# Altium schematic sheet S7CAS-PLEIADES-CARTE-MERE_P20_PLL-decouplage.SchDoc
size Tabloid; Sheet_Name: Insert name in Document Parameters; Size: 11x17
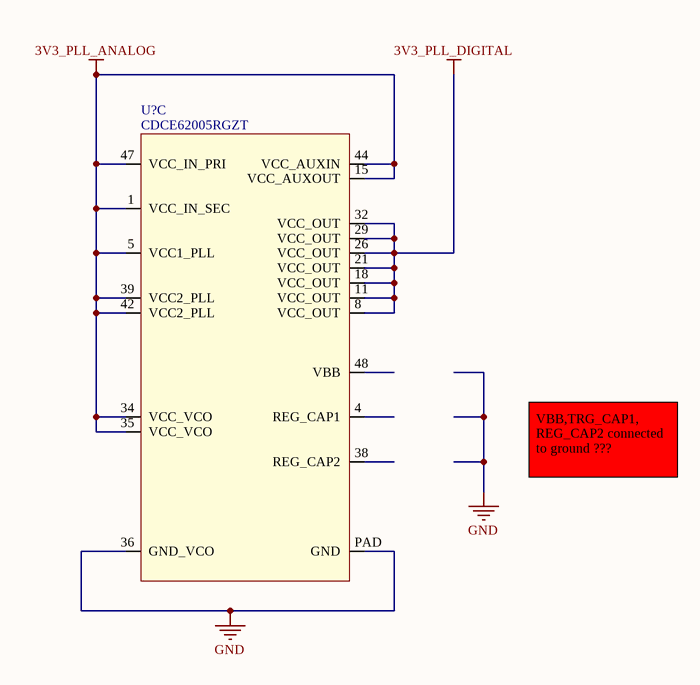
[diagram p0: S7CAS-PLEIADES-CARTE-MERE_P20_PLL-decouplage.SchDoc]

## Parts
U?  CDCE62005RGZT  [TIM_CDCE62005RGZT]  (part C of 3)

## Nets
3V3_PLL_ANALOG: U?.1(VCC_IN_SEC) U?.5(VCC1_PLL) U?.15(VCC_AUXOUT) U?.34(VCC_VCO) U?.35(VCC_VCO) U?.39(VCC2_PLL) U?.42(VCC2_PLL) U?.44(VCC_AUXIN) U?.47(VCC_IN_PRI)
3V3_PLL_DIGITAL: U?.8(VCC_OUT) U?.11(VCC_OUT) U?.18(VCC_OUT) U?.21(VCC_OUT) U?.26(VCC_OUT) U?.29(VCC_OUT) U?.32(VCC_OUT)
GND: U?.36(GND_VCO) U?.PAD(GND)

Not connected (* = marked no-connect by the designer): U? 4(REG_CAP1) 38(REG_CAP2) 48(VBB)

## Notes on the sheet
- VBB,TRG_CAP1, REG_CAP2 connected to ground ???
- Sheet Name
- Project Title
- Global Project
- Size
- Group
- Revision
- Date
- Sheet
- of
- Filename
- Designers

## Library data of the parts
U? = TIM_CDCE62005RGZT: TIM - CLK SYNTH JITTER CLEANER 3:5 - QFN-48; Voltage: 3 V ~ 3.6 V; Mfg: Texas Instruments; Current: *; Power: *; Mfg Part Number: CDCE62005RGZT; HelpURL: http://www.ti.com/lit/ds/symlink/cdce62005.pdf; CreatedBy: Jonathan Bouchard; Temperature: -40°C ~ 85°C; Value: *; Precision: *; Package: QFN-48; Supplier 1: Digikey; Supplier Part Number 1: 296-23947-1-ND